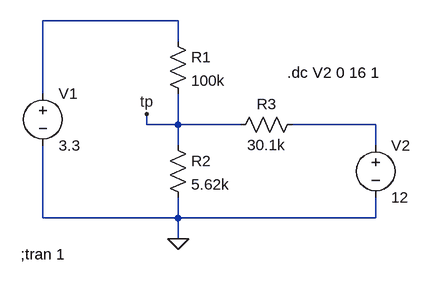
[diagram p0: schematic BattNet.asc]
BattNet.asc, the LTspice schematic file:
Version 4
SHEET 1 880 680
WIRE 160 0 -48 0
WIRE 160 32 160 0
WIRE -48 112 -48 0
WIRE 112 160 112 144
WIRE 160 160 160 112
WIRE 160 160 112 160
WIRE 256 160 160 160
WIRE 464 160 336 160
WIRE 160 192 160 160
WIRE 464 192 464 160
WIRE -48 304 -48 192
WIRE 160 304 160 272
WIRE 160 304 -48 304
WIRE 464 304 464 272
WIRE 464 304 160 304
WIRE 160 336 160 304
FLAG 160 336 0
FLAG 112 144 tp
SYMBOL voltage -48 96 R0
WINDOW 123 0 0 Left 2
WINDOW 39 0 0 Left 2
SYMATTR InstName V1
SYMATTR Value 3.3
SYMBOL res 144 16 R0
SYMATTR InstName R1
SYMATTR Value 100k
SYMATTR SpiceLine tol=1% pwr=.25
SYMBOL res 144 176 R0
SYMATTR InstName R2
SYMATTR Value 5.62k
SYMATTR SpiceLine tol=1% pwr=.25
SYMBOL res 352 144 R90
WINDOW 0 0 56 VBottom 2
WINDOW 3 32 56 VTop 2
SYMATTR InstName R3
SYMATTR Value 30.1k
SYMATTR SpiceLine tol=1% pwr=.25
SYMBOL voltage 464 176 R0
WINDOW 123 0 0 Left 2
WINDOW 39 0 0 Left 2
SYMATTR InstName V2
SYMATTR Value 12
TEXT -82 360 Left 2 !;tran 1
TEXT 328 80 Left 2 !.dc V2 0 16 1

The netlist it stands for:
* BattNet.asc
V1 N001 0 3.3
R1 N001 tp 100k tol=1% pwr=.25
R2 tp 0 5.62k tol=1% pwr=.25
R3 N002 tp 30.1k tol=1% pwr=.25
V2 N002 0 12
;tran 1
.dc V2 0 16 1
.backanno
.end